# Altium schematic sheet BQ24610.SchDoc
size A3; Organization: Altium Limited; Address1: L3, 12a Rodborough Rd; Address2: Frenchs Forest; Address3: NSW; Address4: Australia 2086
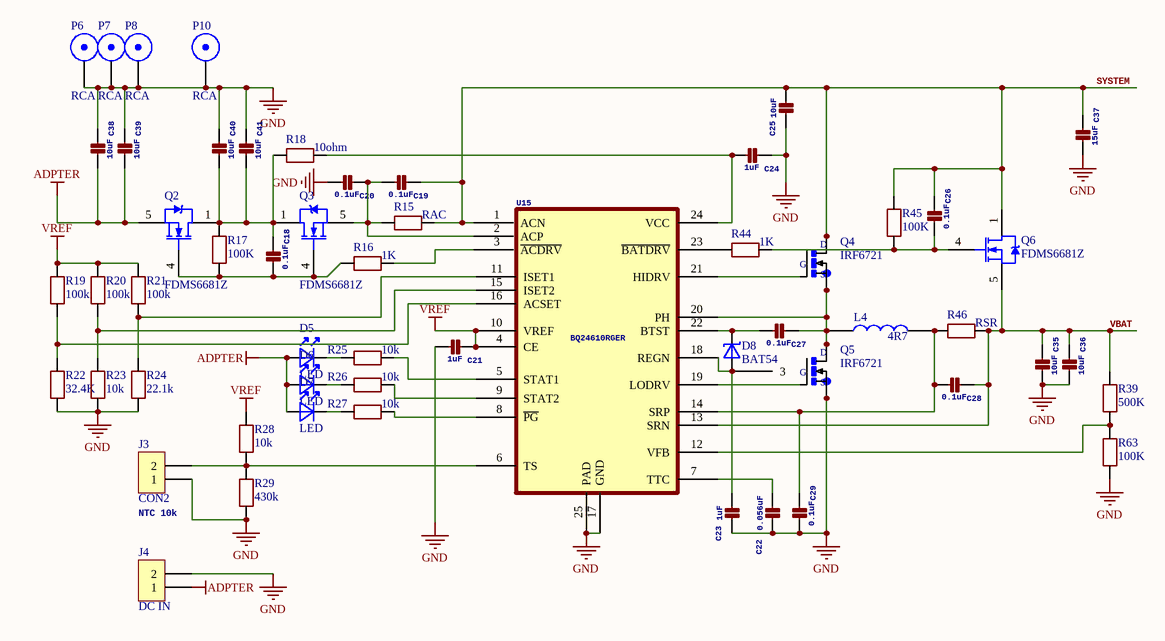
[diagram p0: BQ24610.SchDoc]

## Parts
C18  0.1uF  [0603AC]
C19  0.1uF  [0603AC]
C20  0.1uF  [0603AC]
C21  1uF  [0603AC]
C22  0.056uF  [0603AC]
C23  1uF  [0603AC]
C24  1uF  [0603AC]
C25  10uF  [0603AC]
C26  0.1uF  [0603AC]
C27  0.1uF  [0603AC]
C28  0.1uF  [0603AC]
C29  0.1uF  [0603AC]
C35  10uF  [1210]
C36  10uF  [1210]
C37  15uF  [2220]
C38  10uF  [1206]
C39  10uF  [1206]
C40  10uF  [1206]
C41  10uF  [1206]
D5  LED  [LED-0805]
D6  LED  [LED-0805]
D7  LED  [LED-0805]
D8  BAT54  [sot-23]
J3  CON2  [SIP02]
J4  DC IN  [DCIN]
L4  4R7  [IHLP5050]
P6  RCA  [定位孔 Φ3 1]
P7  RCA  [定位孔 Φ3 1]
P8  RCA  [定位孔 Φ3 1]
P10  RCA  [定位孔 Φ3 1]
Q2  FDMS6681Z  [SON8]
Q3  FDMS6681Z  [SON8]
Q4  IRF6721  [DIRECTFET_IRF6721Primary)]
Q5  IRF6721  [DIRECTFET_IRF6721Primary)]
Q6  FDMS6681Z  [SON8]
R15  RAC  [2010]
R16  1K  [0603AR]
R17  100K  [0603AR]
R18  10ohm  [0603AR]
R19  100k  [0603AR]
R20  100k  [0603AR]
R21  100k  [0603AR]
R22  32.4K  [0603AR]
R23  10k  [0603AR]
R24  22.1k  [0603AR]
R25  10k  [0603AR]
R26  10k  [0603AR]
R27  10k  [0603AR]
R28  10k  [0603AR]
R29  430k  [0603AR]
R39  500K  [0603AR]
R44  1K  [0603AR]
R45  100K  [0603AR]
R46  RSR  [2010]
R63  100K  [0603AR]
U15  BQ24610RGER  [QFN-24]

## Nets
ADPTER: C38.2 C39.2 D5.1 D6.1 D7.1 J4.1 Q2.5(S)
GND: C20.2 C21.2 C22.1 C23.1 C24.1 C25.1 C29.2 C35.2 C36.2 C37.2 C38.1 C39.1 C40.1 C41.1 J3.1 J4.2 P6.1(X) P7.1(X) P8.1(X) P10.1(X) Q5.S R22.2 R23.2 R24.2 R29.1 R63.2 U15.17(GND) U15.25(PAD)
VREF: C21.1 R19.1 R20.1 R21.1 R28.2 U15.4(CE) U15.10(VREF)
SYSTEM: C19.1 C25.2 C26.1 C37.1 Q4.D Q6.1(D) R15.1 R45.1 U15.1(ACN)
VBAT: C28.1 C35.1 C36.1 Q6.5(S) R39.1 R46.1 U15.13(SRN)
NetC18_1: C18.1 C40.2 C41.2 Q2.1(D) Q3.1(D) R17.1 R18.2
NetC18_2: C18.2 Q2.4(G) Q3.4(G) R16.2 R17.2
NetC19_2: C19.2 C20.1 Q3.5(S) R15.2 U15.2(ACP)
NetC22_2: C22.2 U15.7(TTC)
NetC23_2: C23.2 D8.1 D8.2(3) U15.18(REGN)
NetC24_2: C24.2 R18.1 U15.24(VCC)
NetC26_2: C26.2 Q6.4(G) R44.1 R45.2
NetC27_1: C27.1 L4.1 Q4.S Q5.D U15.20(PH)
NetC27_2: C27.2 D8.3 U15.22(BTST)
NetC28_2: C28.2 C29.1 L4.2 R46.2 U15.14(SRP)
NetD5_2: D5.2 R25.1
NetD6_2: D6.2 R26.1
NetD7_2: D7.2 R27.1
NetJ3_2: J3.2 R28.1 R29.2 U15.6(TS)
NetQ4_G: Q4.G U15.21(HIDRV)
NetQ5_G: Q5.G U15.19(LODRV)
NetR16_1: R16.1 U15.3(~{ACDRV})
NetR19_2: R19.2 R22.1 U15.16(ACSET)
NetR20_2: R20.2 R23.1 U15.15(ISET2)
NetR21_2: R21.2 R24.1 U15.11(ISET1)
NetR25_2: R25.2 U15.5(STAT1)
NetR26_2: R26.2 U15.9(STAT2)
NetR27_2: R27.2 U15.8(~{PG})
NetR39_2: R39.2 R63.1 U15.12(VFB)
NetR44_2: R44.2 U15.23(~{BATDRV})

## Notes on the sheet
- (near J3) NTC 10k
- Title
- Size:
- Date:
- A3
- Number:
- Time:
- Revision:
- Sheet
- of
- File:

## Library data of the parts
C18-C29 C35-C41 = CAP: Ceramic CapacitorsFor new designs, use the packages preceded by an '_' character since they are more reliable:The following footprints should be used on most boards:For extremely tight-pitch boards where space is at a premium, the following 'micro-pitch' footprints can be used (smaller pads, no silkscreen outline, etc.):; GateName_1: G$1; DeviceName: 0603-NOOUTLINE; DeviceSetName: CAP_CERAMIC; SymbolName_1: CAPACITOR; LibraryName: microbuilder
D5-D7 = LED: 0805 LED
D8 = DIODE SCHOTTKY_1
J3 J4 = CON2: Therm
L4 = INDUCTOR1
P6-P8 P10 = RCA: RCA Connector
Q2 Q3 Q6 = N-Mosfet
Q4 Q5 = IRF6648: Mosfet n-Ch 60v 86a Directfet  -  Irf6648; MF: Infineon; Package: None; MP: IRF6648; SnapEDA_Link: https://www.snapeda.com/parts/IRF6648/Infineon%20Technologies/view-part/?ref=snap; Availability: Unavailable; Price: None; Value: *
R15 R46 = RES2: 0.01OHM
R16-R29 R39 R44 R45 R63 = RES2
U15 = BQ24610RGER: Stand-Alone Synchronous Switched-Mode Li-Ion or Li-Polymer Battery Charger / With System Power Selector and Low Iq